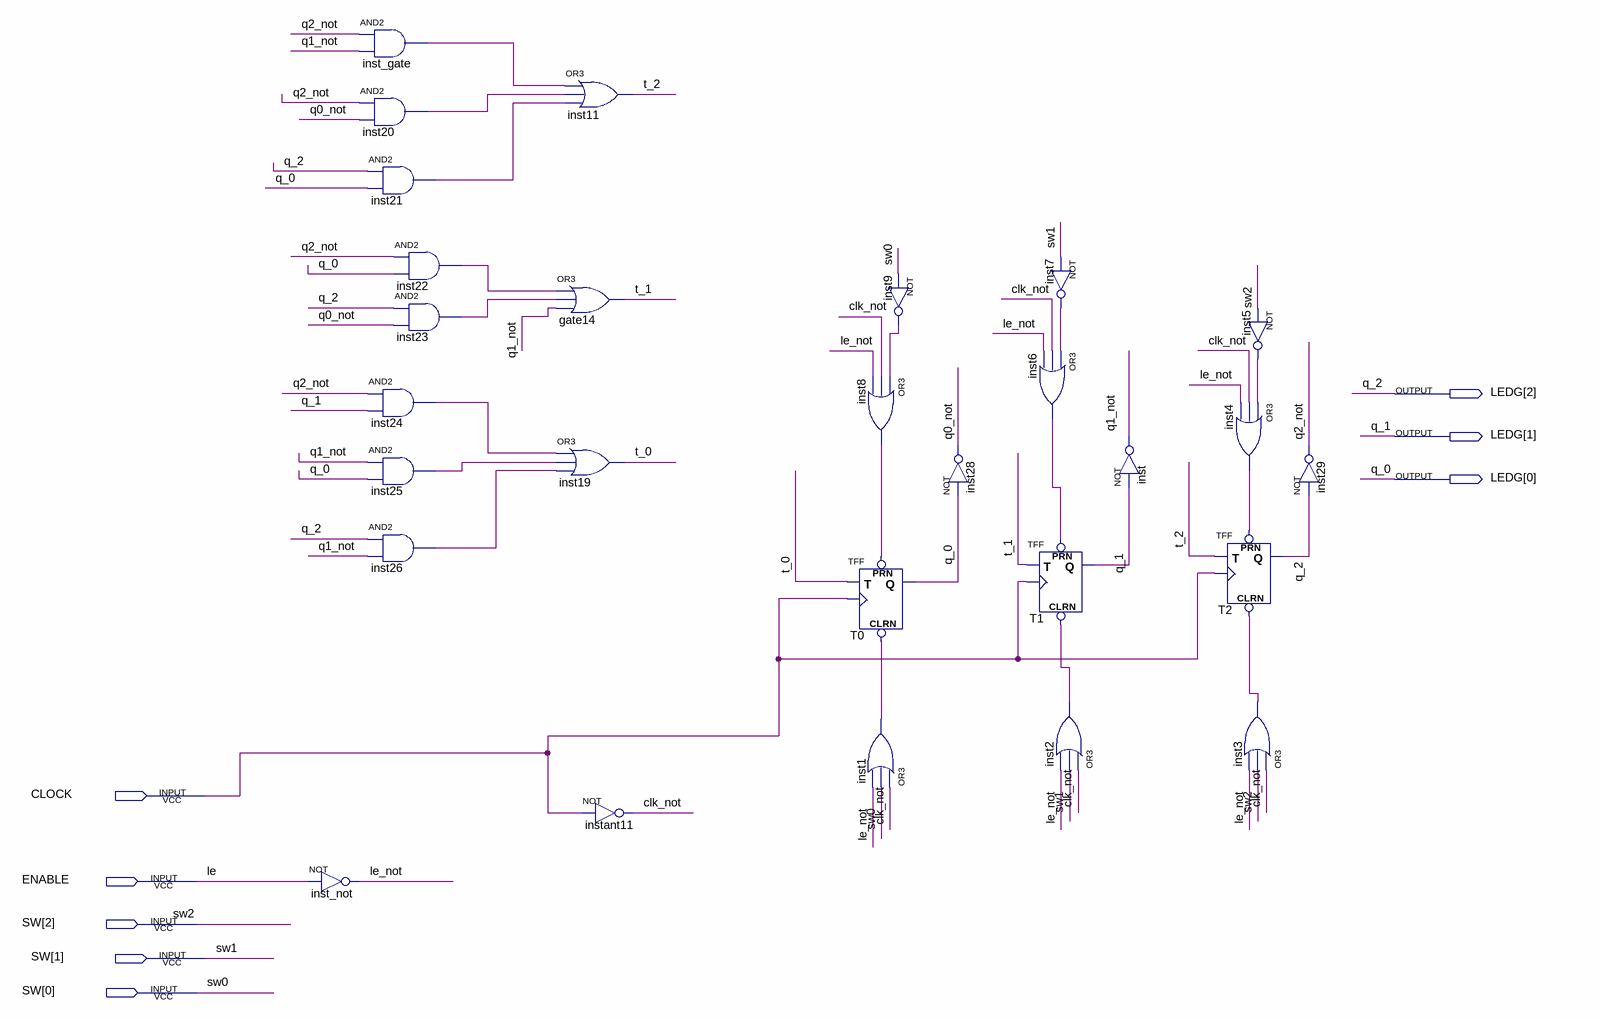
[diagram p0: schematic sheet]
// Quartus schematic LAB_1.bdf as structural Verilog: 28 symbols, 8 pins
module LAB_1 (
  input  CLOCK,
  input  ENABLE,
  input  [2:0] SW,
  output [2:0] LEDG
);

  wire clk_not, inst1_out, inst2_out, inst3_out, inst4_out, inst5_out, inst6_out, inst7_out, inst8_out,
       inst9_out, inst20_out, inst21_out, inst22_out, inst23_out, inst24_out, inst25_out, inst26_out,
       inst_gate_out, le_not, q0_not, q1_not, q2_not, t_0, t_1, t_2;

  not inst_not (le_not, ENABLE);
  and inst_gate (inst_gate_out, q2_not, q1_not);
  and inst20 (inst20_out, q2_not, q0_not);
  and inst21 (inst21_out, LEDG[2], LEDG[0]);
  and inst22 (inst22_out, q2_not, LEDG[0]);
  and inst23 (inst23_out, LEDG[2], q0_not);
  and inst24 (inst24_out, q2_not, LEDG[1]);
  and inst25 (inst25_out, q1_not, LEDG[0]);
  and inst26 (inst26_out, LEDG[2], q1_not);
  or inst11 (t_2, inst_gate_out, inst20_out, inst21_out);
  or gate14 (t_1, inst22_out, inst23_out, q1_not);
  or inst19 (t_0, inst24_out, inst25_out, inst26_out);
  not instant11 (clk_not, CLOCK);
  not inst9 (inst9_out, SW[0]);
  or inst8 (inst8_out, inst9_out, clk_not, le_not);
  TFF T0 (.PRN(inst8_out), .CLRN(inst1_out), .T(t_0), .CLK(CLOCK), .Q(LEDG[0]));
  or inst1 (inst1_out, clk_not, SW[0], le_not);
  not inst28 (q0_not, LEDG[0]);
  not inst7 (inst7_out, SW[1]);
  or inst6 (inst6_out, inst7_out, clk_not, le_not);
  TFF T1 (.PRN(inst6_out), .CLRN(inst2_out), .T(t_1), .CLK(CLOCK), .Q(LEDG[1]));
  or inst2 (inst2_out, clk_not, SW[1], le_not);
  not inst (q1_not, LEDG[1]);
  or inst4 (inst4_out, inst5_out, clk_not, le_not);
  TFF T2 (.PRN(inst4_out), .CLRN(inst3_out), .T(t_2), .CLK(CLOCK), .Q(LEDG[2]));
  not inst5 (inst5_out, SW[2]);
  not inst29 (q2_not, LEDG[2]);
  or inst3 (inst3_out, clk_not, SW[2], le_not);

  // Other names for the same wires on the sheet: le = ENABLE; q_0 = LEDG[0]; q_1 = LEDG[1]; q_2 = LEDG[2]
endmodule
